# EAGLE schematic I2CLed (EAGLE 5.04)
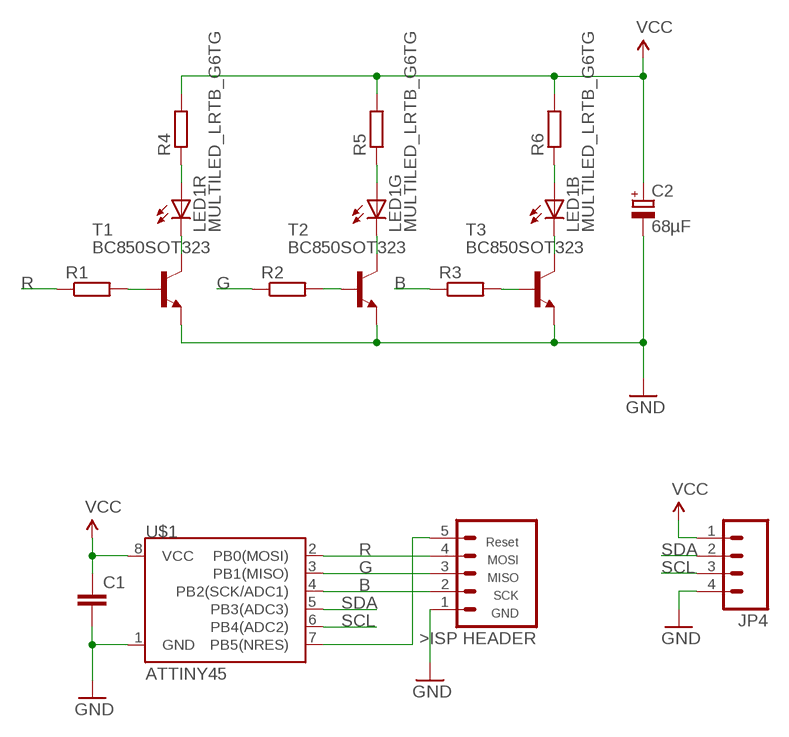
[diagram p0: schematic, sheet 1]

## Parts
C1  C-EUC0603  [C0603]
C2  68µF  CPOL-EUD  [PANASONIC_D]
JP4  M041.27MM  [1X04-1.27MM]
LED1  MULTILED_LRTB_G6TG  [P-LCC-6_TOPLED]
R1  R-EU_R0603  [R0603]
R2  R-EU_R0603  [R0603]
R3  R-EU_R0603  [R0603]
R4  R-EU_R0603  [R0603]
R5  R-EU_R0603  [R0603]
R6  R-EU_R0603  [R0603]
T1  BC850SOT323  [SOT323-BEC]
T2  BC850SOT323  [SOT323-BEC]
T3  BC850SOT323  [SOT323-BEC]
U$1  ATTINY45  [SO08-EIAJ]
U$2  ISPHEADER  [1X05]

## Nets
B: R3.1 U$1.4(PB2(SCK/ADC1)) U$2.2(SCK)
G: R2.1 U$1.3(PB1(MISO)) U$2.3(MISO)
GND: C1.2 C2.- JP4.4 T1.E T2.E T3.E U$1.1(GND) U$2.1(GND)
N$4: U$1.7(PB5(NRES)) U$2.5(RST)
N$5: LED1.A1(R:A) R4.1
N$6: LED1.C1(R:C) T1.C
N$7: R1.2 T1.B
N$10: R2.2 T2.B
N$11: R3.2 T3.B
N$13: LED1.A2(G:A) R5.1
N$14: LED1.A3(B:A) R6.1
N$15: LED1.C3(B:C) T3.C
N$16: LED1.C2(G:C) T2.C
R: R1.1 U$1.2(PB0(MOSI)) U$2.4(MOSI)
SCL: JP4.3 U$1.6(PB4(ADC2))
SDA: JP4.2 U$1.5(PB3(ADC3))
VCC: C1.1 C2.+ JP4.1 R4.2 R5.2 R6.2 U$1.8(VCC)

## Library data of the parts
C1 = rcl:C-EU: CAPACITOR, European symbol
C2 = rcl:CPOL-EU: POLARIZED CAPACITOR, European symbol
JP4 = SparkFun:M04: Header 4 Standard 4-pin 0.1" header. Use with straight break away headers (SKU : PRT-00116), right angle break away headers (PRT-00553), swiss pins (PRT-00743), machine pins (PRT-00117), and female headers (PRT-00115). Molex polarized connector foot print use with SKU : PRT-08231 with associated crimp pins and housings.
LED1 = led:MULTILED_LRTB_G6TG: 6-lead MULTILED® Enhanced optical Power LED (ThinFilm® / ThinGaN®) Source. OSRAM - LRTB_G6TG.pdf
R1-R6 = resistor:R-EU_: RESISTOR, European symbol
T1-T3 = additional:BC850: NPN TRANSISTOR
U$1 = SparkFun:ATTINY45: Atmel ATTiny45
U$2 = tuxgraphics:ISPHEADER: ISP Header for tuxgraphics.org AvrUsb500 programmer